# EasyEDA schematic sch_design_easyEDA.json
TITLE: Sheet_1; REV: 1.0; Date: 2024-10-02; Sheet: 1/1; Drawn By: willy; Company: Your Company
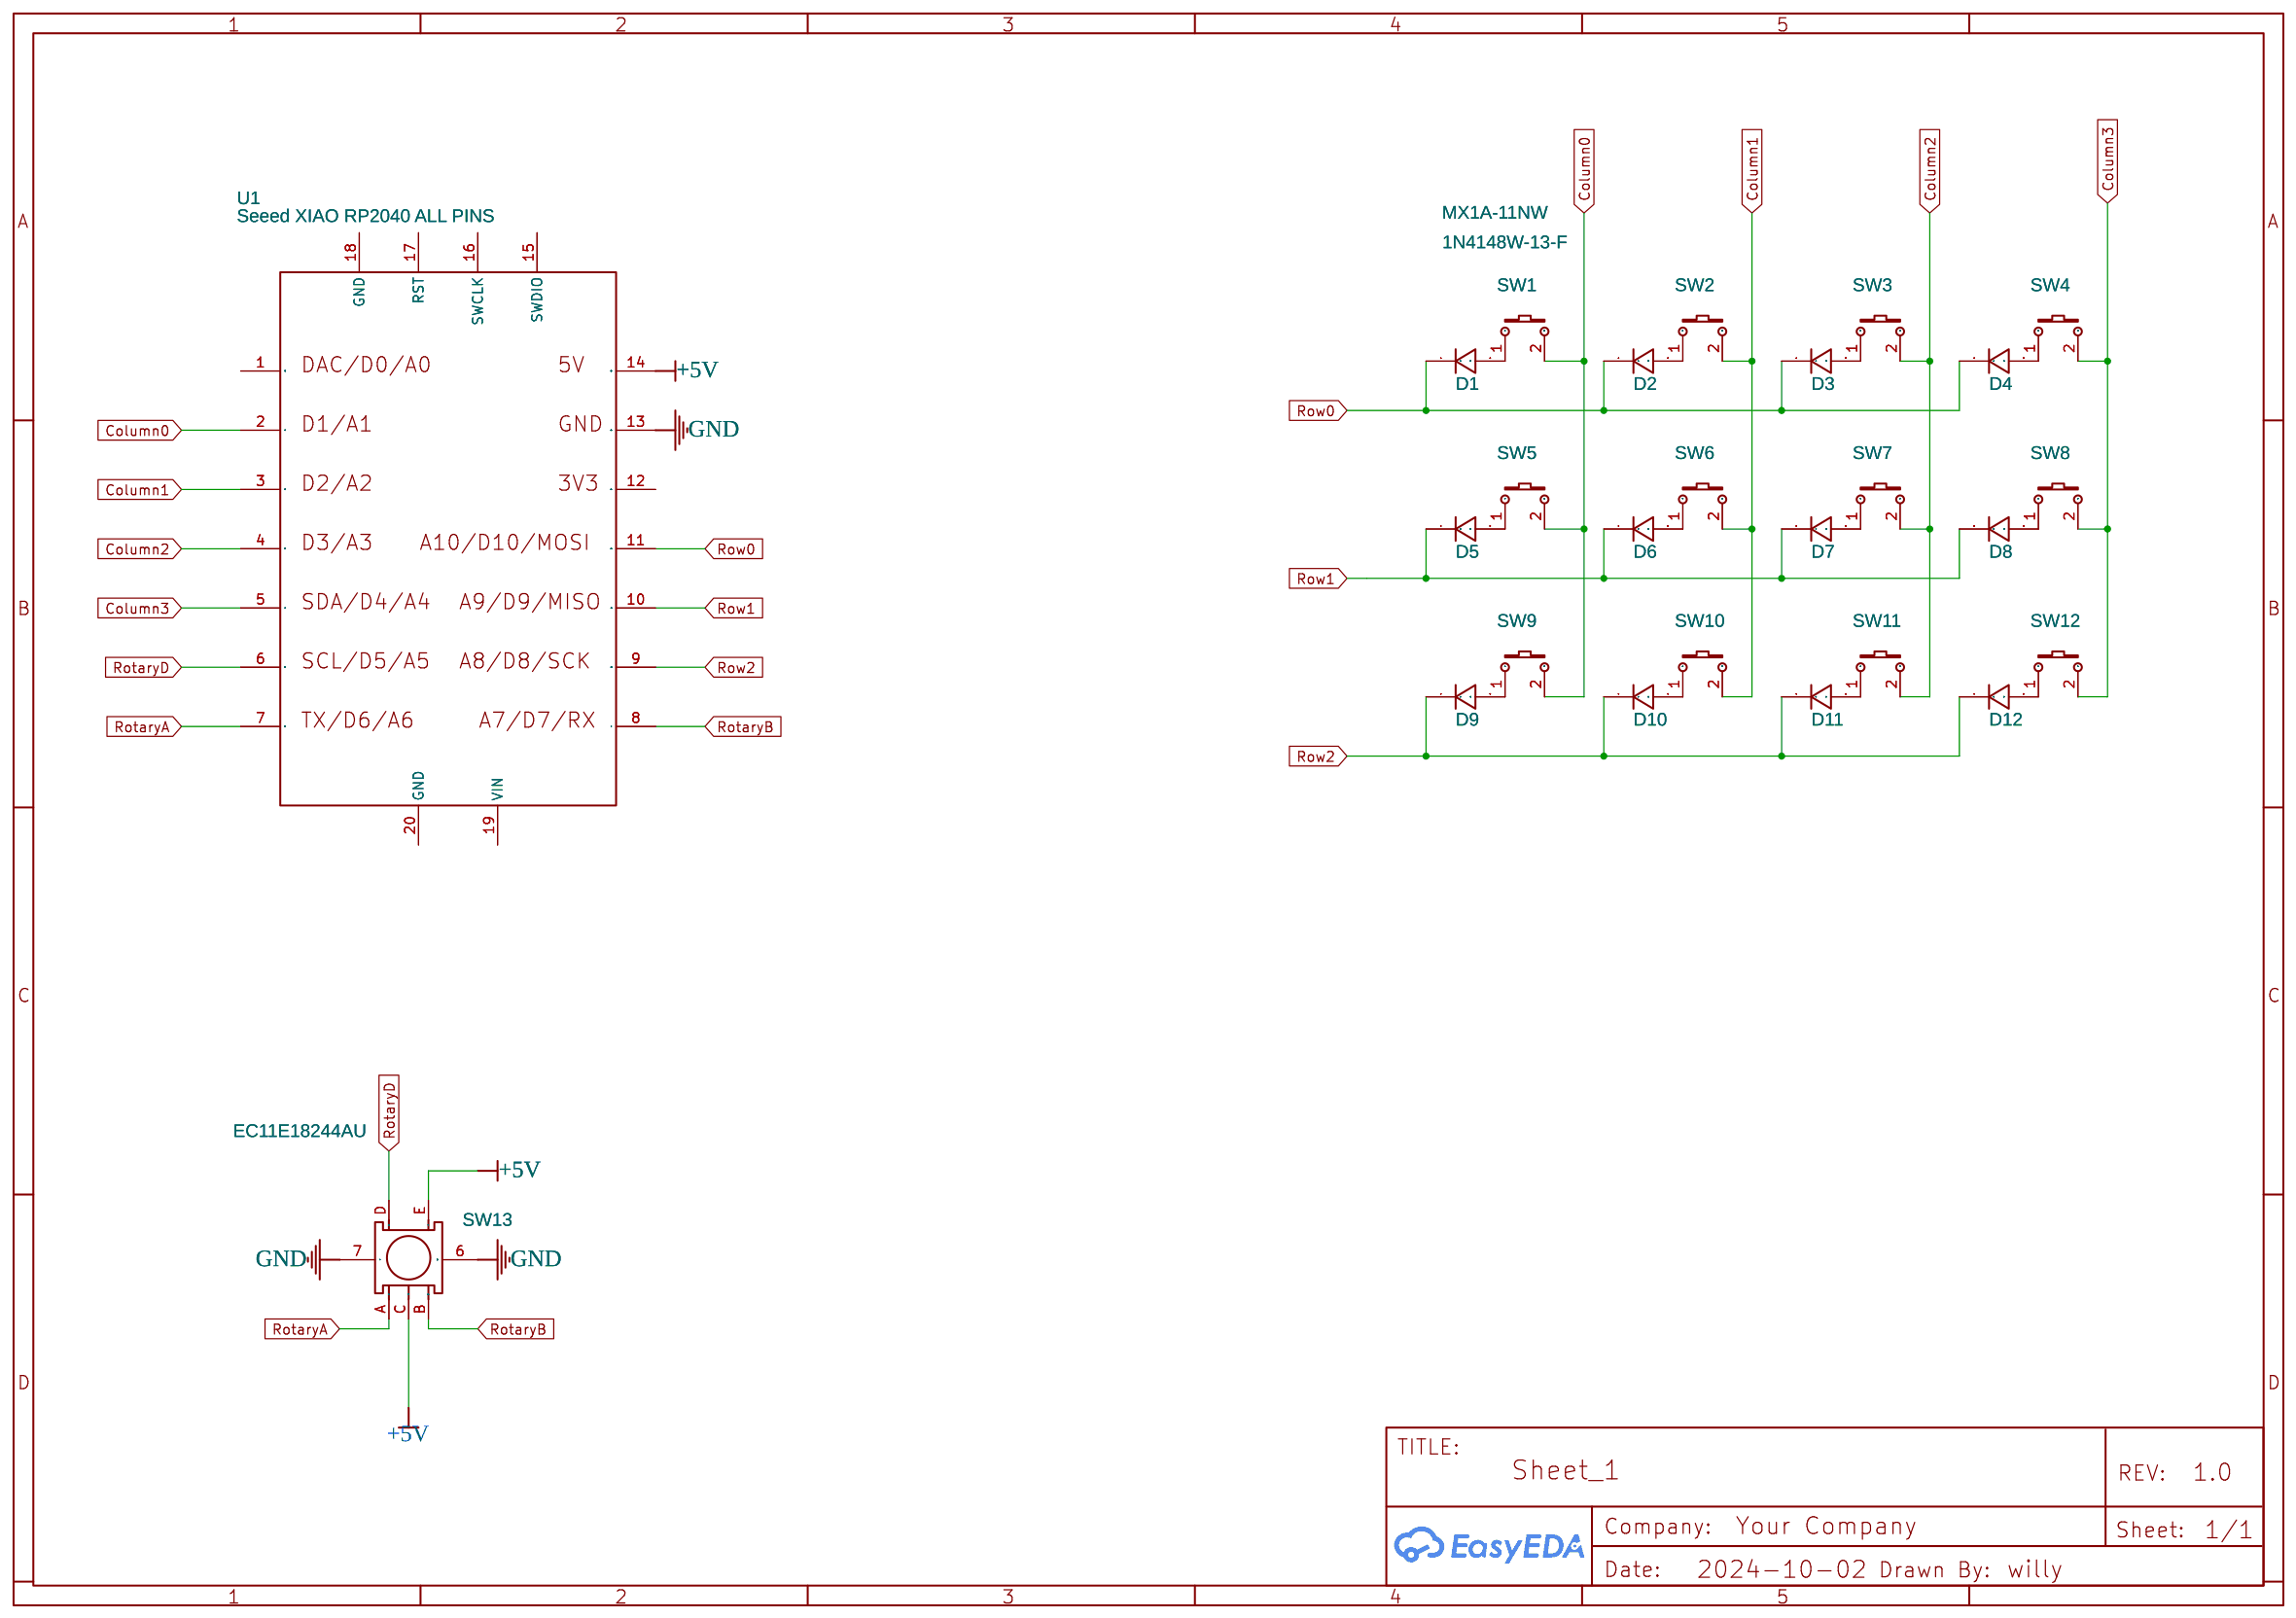
[diagram p0: schematic sheet]

## Parts
D1  1N4148W-13-F  [SOD-123_L2.7-W1.6-LS3.7-RD]
D2  1N4148W-13-F  [SOD-123_L2.7-W1.6-LS3.7-RD]
D3  1N4148W-13-F  [SOD-123_L2.7-W1.6-LS3.7-RD]
D4  1N4148W-13-F  [SOD-123_L2.7-W1.6-LS3.7-RD]
D5  1N4148W-13-F  [SOD-123_L2.7-W1.6-LS3.7-RD]
D6  1N4148W-13-F  [SOD-123_L2.7-W1.6-LS3.7-RD]
D7  1N4148W-13-F  [SOD-123_L2.7-W1.6-LS3.7-RD]
D8  1N4148W-13-F  [SOD-123_L2.7-W1.6-LS3.7-RD]
D9  1N4148W-13-F  [SOD-123_L2.7-W1.6-LS3.7-RD]
D10  1N4148W-13-F  [SOD-123_L2.7-W1.6-LS3.7-RD]
D11  1N4148W-13-F  [SOD-123_L2.7-W1.6-LS3.7-RD]
D12  1N4148W-13-F  [SOD-123_L2.7-W1.6-LS3.7-RD]
SW1  MX1A-11NW  [SW-TH_MX1A-11NW]
SW2  MX1A-11NW  [SW-TH_MX1A-11NW]
SW3  MX1A-11NW  [SW-TH_MX1A-11NW]
SW4  MX1A-11NW  [SW-TH_MX1A-11NW]
SW5  MX1A-11NW  [SW-TH_MX1A-11NW]
SW6  MX1A-11NW  [SW-TH_MX1A-11NW]
SW7  MX1A-11NW  [SW-TH_MX1A-11NW]
SW8  MX1A-11NW  [SW-TH_MX1A-11NW]
SW9  MX1A-11NW  [SW-TH_MX1A-11NW]
SW10  MX1A-11NW  [SW-TH_MX1A-11NW]
SW11  MX1A-11NW  [SW-TH_MX1A-11NW]
SW12  MX1A-11NW  [SW-TH_MX1A-11NW]
SW13  EC11E18244AU  [SW-TH_EC11XXXXXXXX]
U1  Seeed XIAO RP2040 ALL PINS  [SEEED XIAO RP2040]

## Library data of the parts
D1-D12 = 1N4148W-13-F: Contributor: LCSC; Supplier Part: C112342; Supplier: LCSC; Manufacturer: DIODES(美台); JLCPCB Part Class: Extended Part
SW1-SW12 = MX1A-11NW: Supplier: LCSC; Supplier Part: C3316924; Manufacturer: CHERRY; Contributor: lcsc
SW13 = EC11E18244AU: Contributor: LCSC; Supplier: LCSC; Supplier Part: C202365; Manufacturer: ALPSALPINE(阿尔卑斯阿尔派); JLCPCB Part Class: Extended Part
U1 = Seeed XIAO RP2040 ALL PINS: Manufacturer: Seeedstudio; Manufacturer Part: 102010328; link: https://www.seeedstudio.com/Seeeduino-XIAO-Arduino-Microcontroller-SAMD21-Cortex-M0+-p-4426.html; Contributor: Derick2k

## Nets
+5V: SW13.C SW13.E U1.14(13)
GND: SW13.6 SW13.7 U1.13(12)
Column0: SW1.2 SW5.2 SW9.2 U1.2(1)
Column1: SW2.2 SW6.2 SW10.2 U1.3(2)
Column2: SW3.2 SW7.2 SW11.2 U1.4(3)
Column3: SW4.2 SW8.2 SW12.2 U1.5(4)
RotaryA: SW13.A U1.7(6)
RotaryB: SW13.B U1.8(7)
RotaryD: SW13.D U1.6(5)
Row0: D1.1 D2.1 D3.1 D4.1 U1.11(10)
Row1: D5.1 D6.1 D7.1 D8.1 U1.10(9)
Row2: D9.1 D10.1 D11.1 D12.1 U1.9(8)
Net-(D1-2): D1.2 SW1.1
Net-(D2-2): D2.2 SW2.1
Net-(D3-2): D3.2 SW3.1
Net-(D4-2): D4.2 SW4.1
Net-(D5-2): D5.2 SW5.1
Net-(D6-2): D6.2 SW6.1
Net-(D7-2): D7.2 SW7.1
Net-(D8-2): D8.2 SW8.1
Net-(D9-2): D9.2 SW9.1
Net-(D10-2): D10.2 SW10.1
Net-(D11-2): D11.2 SW11.1
Net-(D12-2): D12.2 SW12.1

Not connected (* = marked no-connect by the designer): U1 1(0) 12(11) 15(SWDIO) 16(SWCLK) 17(RST) 18(GND) 19(VIN) 20(GND)
